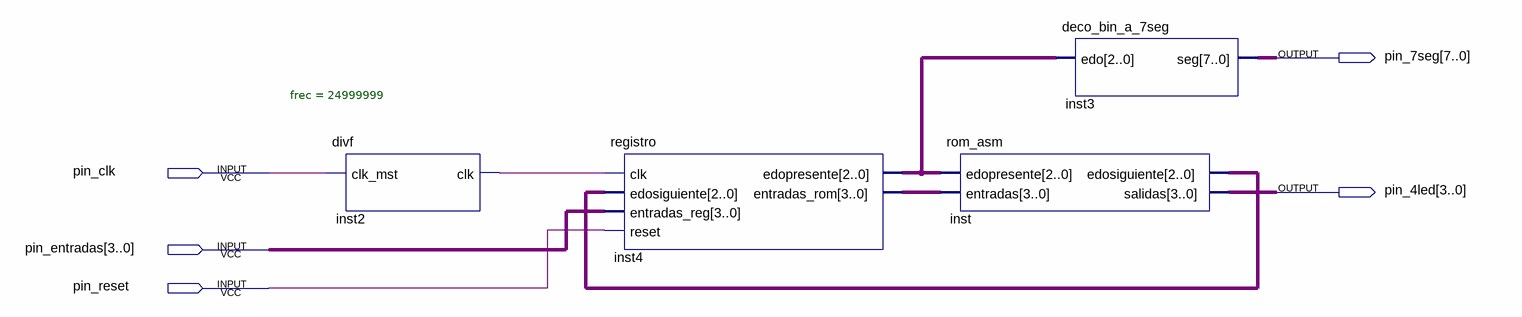
[diagram p0: schematic sheet]
// Quartus schematic practica02_main.bdf as structural Verilog: 4 symbols, 5 pins
module practica02_main (
  input  pin_clk,
  input  [3:0] pin_entradas,
  input  pin_reset,
  output [7:0] pin_7seg,
  output [3:0] pin_4led
);

  wire inst2_clk;
  wire [2:0] inst4_edopresente, inst_edosiguiente;
  wire [3:0] inst4_entradas_rom;

  divf #(.frec(24999999)) inst2 (.clk_mst(pin_clk), .clk(inst2_clk));
  registro inst4 (
    .clk(inst2_clk), .edosiguiente(inst_edosiguiente), .entradas_reg(pin_entradas), .reset(pin_reset),
    .edopresente(inst4_edopresente), .entradas_rom(inst4_entradas_rom));
  rom_asm inst (
    .edopresente(inst4_edopresente), .entradas(inst4_entradas_rom), .edosiguiente(inst_edosiguiente),
    .salidas(pin_4led));
  deco_bin_a_7seg inst3 (.edo(inst4_edopresente), .seg(pin_7seg));
endmodule
